# Altium project FOC_Lite.PrjPcb
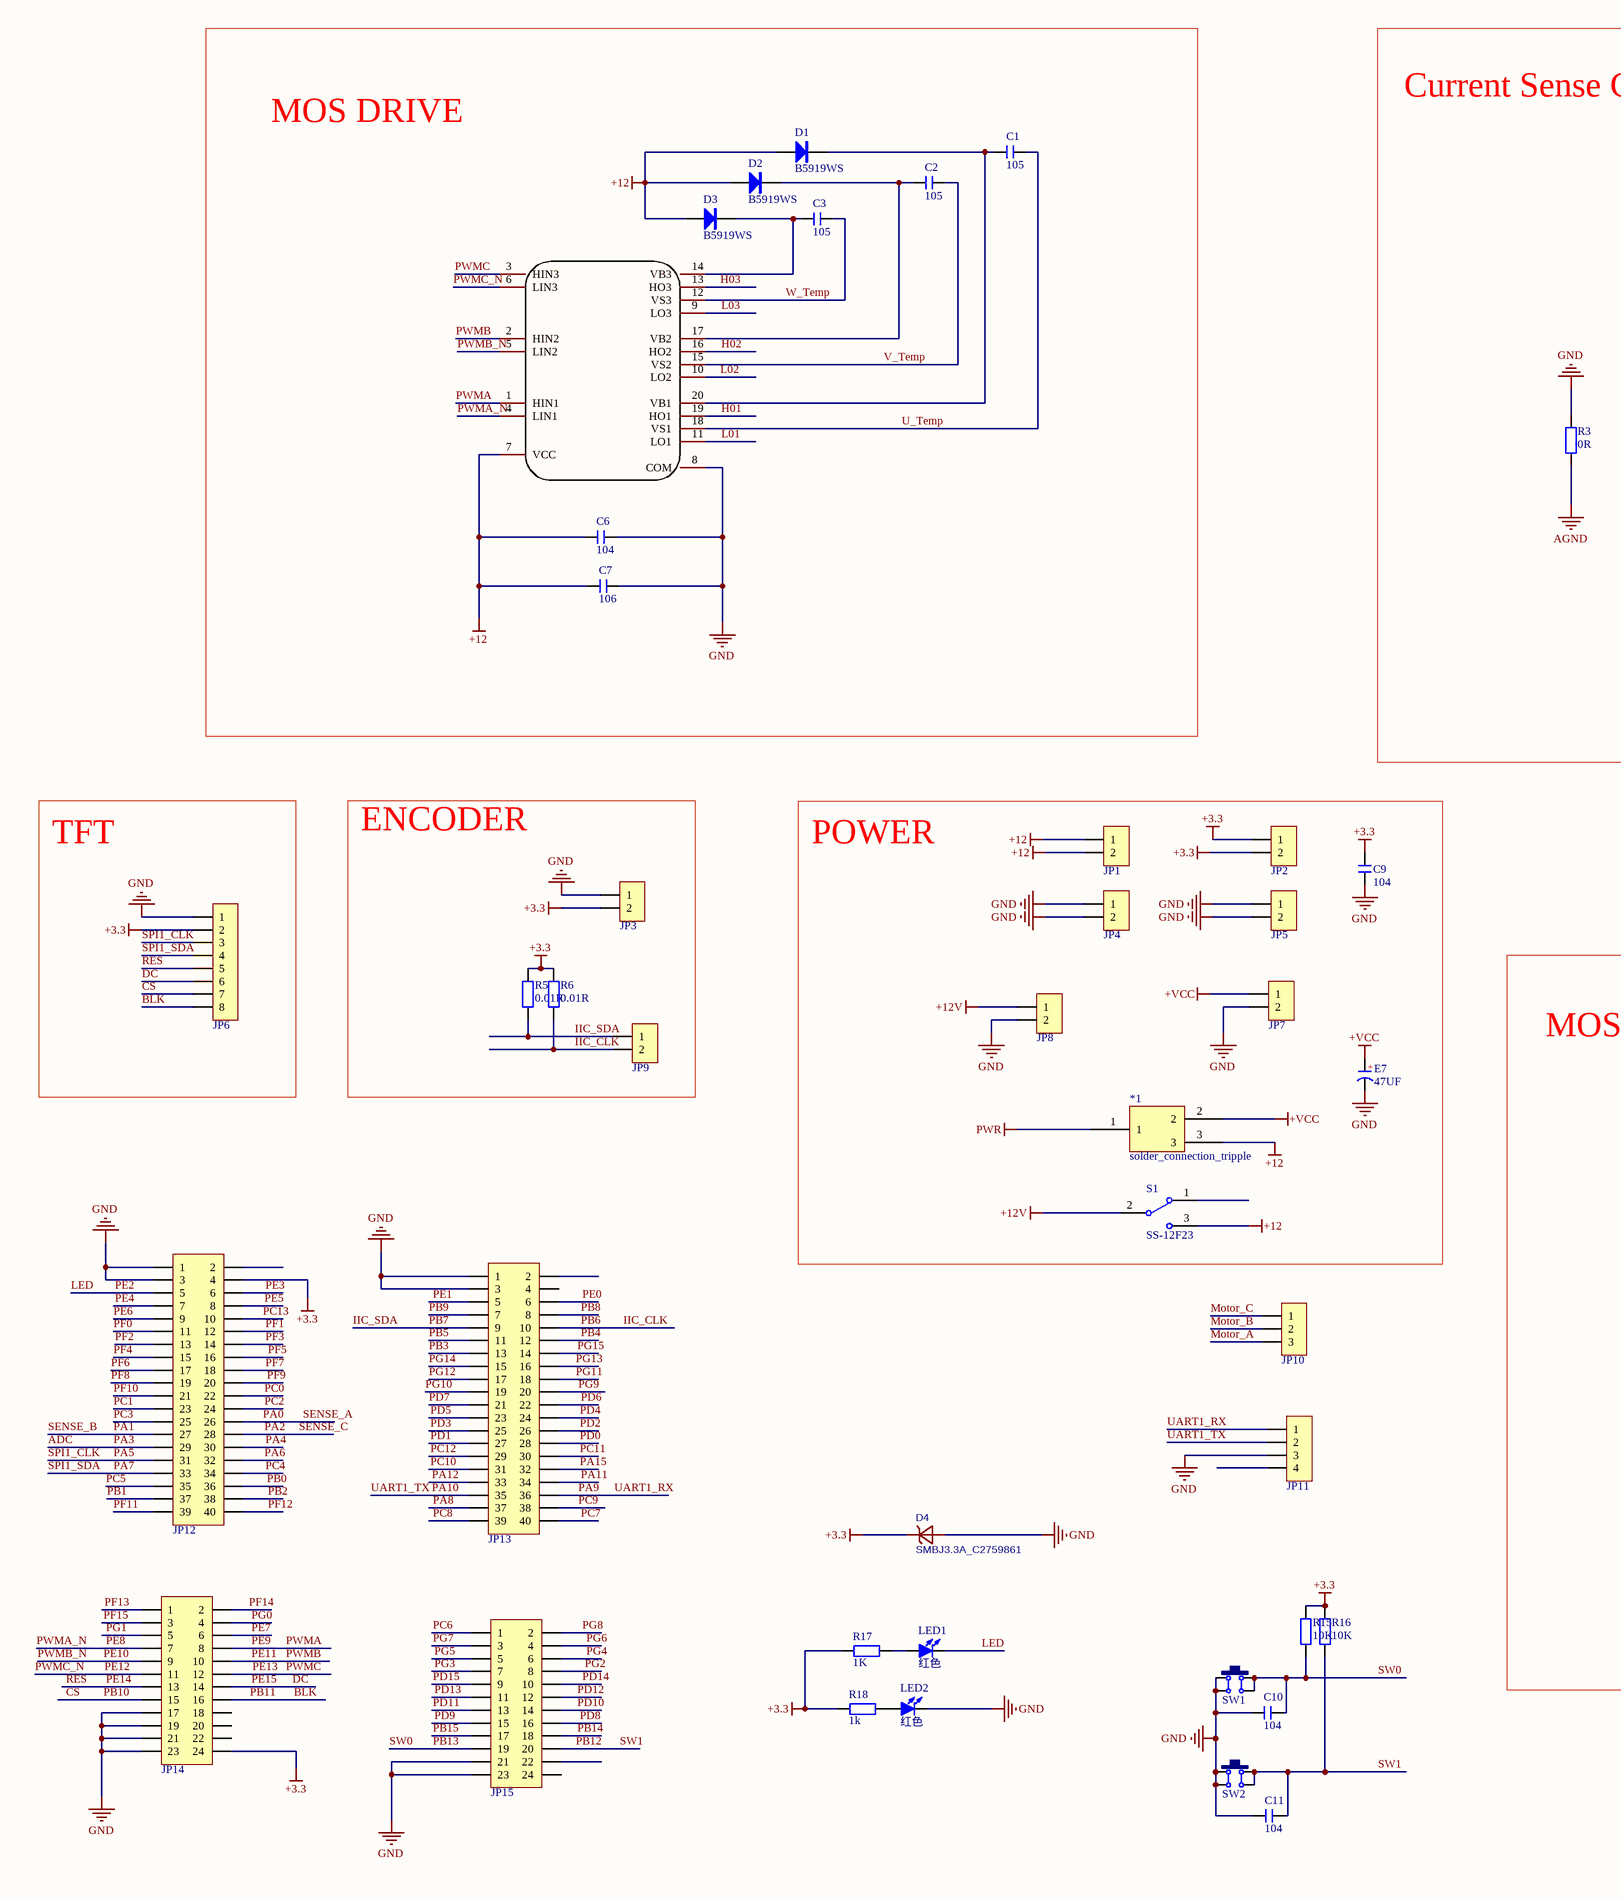
[diagram p0: FOC_Lite.SchDoc, left]
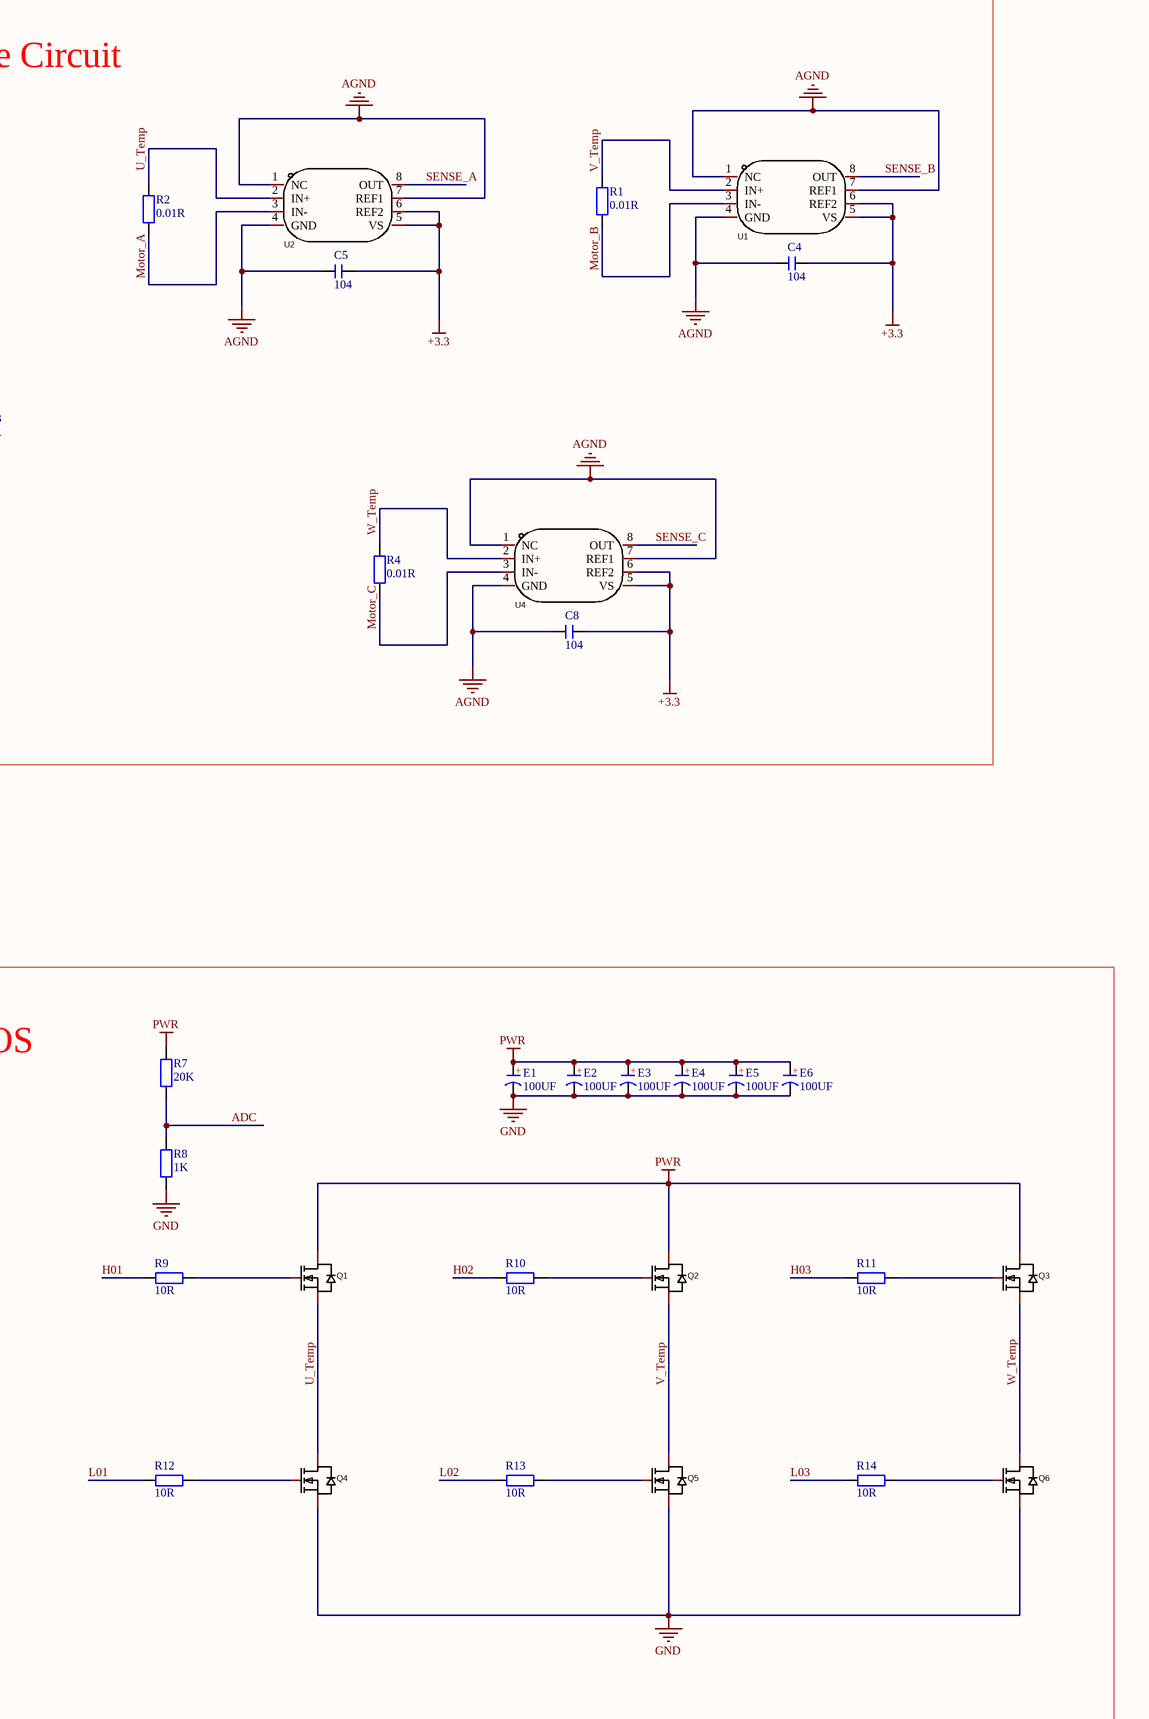
[diagram p1: FOC_Lite.SchDoc, right]
1 sheet, 71 parts. Net scope: global (net labels, ports and power ports of the same name join across sheets).
Board file: FOC_Lite.PcbDoc

## Sheet FOC_Lite.SchDoc
size A2

### Parts
*1  solder_connection_tripple  [solder_connection_tripple_big]
C1  105  [C 0805]
C2  105  [C 0805]
C3  105  [C 0805]
C4  104  [C 0805]
C5  104  [C 0805]
C6  104  [C 0805]
C7  106  [C 0805]
C8  104  [C 0805]
C9  104  [C 0805]
C10  104  [C 0603]
C11  104  [C 0603]
D1  B5919WS  [SOD-323]
D2  B5919WS  [SOD-323]
D3  B5919WS  [SOD-323]
D4  SMBJ3.3A_C2759861  [SMB3.3A]
E1  100UF  [CD D(7343)]
E2  100UF  [CD D(7343)]
E3  100UF  [CD D(7343)]
E4  100UF  [CD D(7343)]
E5  100UF  [CD D(7343)]
E6  100UF  [CD D(7343)]
E7  47UF  [CD D(7343)]
JP1  HDR-1X2  [HDR-1X2]  (value not drawn)
JP2  HDR-1X2  [HDR-1X2]  (value not drawn)
JP3  HDR-1X2  [HDR-1X2]  (value not drawn)
JP4  HDR-1X2  [HDR-1X2]  (value not drawn)
JP5  HDR-1X2  [HDR-1X2]  (value not drawn)
JP6  HDR-1X8  [HDR-1X8]  (value not drawn)
JP7  HDR-1X2  [KF128-5.08-2P]  (value not drawn)
JP8  HDR-1X2  [KF128-5.08-2P]  (value not drawn)
JP9  HDR-1X2  [HDR-1X2]  (value not drawn)
JP10  HDR-1X3  [KF128-5.08-3P]  (value not drawn)
JP11  HDR-1X4  [XH2.54-4P]  (value not drawn)
JP12  Header 2X11  [HDR-20X2]  (value not drawn)
JP13  Header 2X11  [HDR-20X2]  (value not drawn)
JP14  Header 2X11  [HDR-12X2]  (value not drawn)
JP15  Header 2X11  [HDR-12X2]  (value not drawn)
LED1  红色  [LED 0603W]
LED2  红色  [LED 0603W]
Q1  NCE6080K  [TO-252-2_L6.6-W6.1-P4.57-LS10.1-BR-CW]  (value not drawn)
Q2  NCE6080K  [TO-252-2_L6.6-W6.1-P4.57-LS10.1-BR-CW]  (value not drawn)
Q3  NCE6080K  [TO-252-2_L6.6-W6.1-P4.57-LS10.1-BR-CW]  (value not drawn)
Q4  NCE6080K  [TO-252-2_L6.6-W6.1-P4.57-LS10.1-BR-CW]  (value not drawn)
Q5  NCE6080K  [TO-252-2_L6.6-W6.1-P4.57-LS10.1-BR-CW]  (value not drawn)
Q6  NCE6080K  [TO-252-2_L6.6-W6.1-P4.57-LS10.1-BR-CW]  (value not drawn)
R1  0.01R  [R 2512]
R2  0.01R  [R 2512]
R3  0R  [R 0805]
R4  0.01R  [R 2512]
R5  0.01R  [R 0603]
R6  0.01R  [R 0603]
R7  20K  [R 0603]
R8  1K  [R 0603]
R9  10R  [R 2512]
R10  10R  [R 2512]
R11  10R  [R 2512]
R12  10R  [R 2512]
R13  10R  [R 2512]
R14  10R  [R 2512]
R15  10K  [R 0603]
R16  10K  [R 0603]
R17  1K  [R 0603]
R18  1k  [R 0603]
S1  SS-12F23  [SS12D10]
SW1  6x6x5  [TSW DIP-6*6*6]  (value not drawn)
SW2  6x6x5  [TSW DIP-6*6*6]  (value not drawn)
U1  INA240A2PWR  [TSSOP-8_L4.4-W3.0-P0.65-LS6.4-BL]  (value not drawn)
U2  INA240A2PWR  [TSSOP-8_L4.4-W3.0-P0.65-LS6.4-BL]  (value not drawn)
U3  FD6288T  [FD6288T]  (value not drawn)
U4  INA240A2PWR  [TSSOP-8_L4.4-W3.0-P0.65-LS6.4-BL]  (value not drawn)

### Blocks framed on the sheet
MOS DRIVE: C1-C3 C6 C7 D1-D3 U3
Current Sense Circuit: C4 C5 C8 R1-R4 U1 U2 U4
TFT: JP6
ENCODER: JP3 JP9 R5 R6
POWER: *1 C9 E7 JP1 JP2 JP4 JP5 JP7 JP8 S1
MOS: E1-E6 Q1-Q6 R7-R14

### Nets
+3.3: C4.2 C5.2 C8.2 C9.2 D4.1 JP2.1 JP2.2 JP3.2 JP6.2 JP12.4 JP14.24 R5.2 R6.2 R15.1 R16.1 R17.2 R18.1 U1.5(VS) U1.6(REF2) U2.5(VS) U2.6(REF2) U4.5(VS) U4.6(REF2)
+12: *1.3 C6.1 C7.1 D1.1(A) D2.1(A) D3.1(A) JP1.1 JP1.2 S1.3 U3.7(VCC)
+12V: JP8.1 S1.2
+VCC: *1.2 E7.1(A) JP7.1
AGND: C4.1 C5.1 C8.1 R3.1 U1.1(NC) U1.4(GND) U1.7(REF1) U2.1(NC) U2.4(GND) U2.7(REF1) U4.1(NC) U4.4(GND) U4.7(REF1)
GND: C6.2 C7.2 C9.1 C10.2 C11.2 D4.2 E1.2(K) E2.2(K) E3.2(K) E4.2(K) E5.2(K) E6.2(K) E7.2(K) JP3.1 JP4.1 JP4.2 JP5.1 JP5.2 JP6.1 JP7.2 JP8.2 JP11.3 JP12.1 JP12.3 JP13.1 JP13.3 JP14.17 JP14.19 JP14.21 JP14.23 JP15.21 JP15.23 LED2.2(K) Q4.3(S) Q5.3(S) Q6.3(S) R3.2 R8.2 SW1.1 SW1.4 SW2.1 SW2.4 U3.8(COM)
PWR: *1.1 E1.1(A) E2.1(A) E3.1(A) E4.1(A) E5.1(A) E6.1(A) Q1.2(D) Q2.2(D) Q3.2(D) R7.1
ADC: JP12.29 R7.2 R8.1  [also labelled PA3]
BLK: JP6.8 JP14.16  [also labelled PB11]
CS: JP6.7 JP14.15  [also labelled PB10]
DC: JP6.6 JP14.14  [also labelled PE15]
H01: R9.2 U3.19(HO1)
H02: R10.2 U3.16(HO2)
H03: R11.2 U3.13(HO3)
IIC_CLK: JP9.2 JP13.10 R6.1  [also labelled PB6]
IIC_SDA: JP9.1 JP13.9 R5.1  [also labelled PB7]
L01: R12.2 U3.11(LO1)
L02: R13.2 U3.10(LO2)
L03: R14.2 U3.9(LO3)
LED: JP12.5 LED1.2(K)  [also labelled PE2]
Motor_A: JP10.3 R2.1 U2.3(IN-)
Motor_B: JP10.2 R1.1 U1.3(IN-)
Motor_C: JP10.1 R4.1 U4.3(IN-)
PA0: JP12.26 U2.8(OUT)  [also labelled SENSE_A]
PA1: JP12.27 U1.8(OUT)  [also labelled SENSE_B]
PA2: JP12.28 U4.8(OUT)  [also labelled SENSE_C]
PA4: JP12.30
PA5: JP6.3 JP12.31  [also labelled SPI1_CLK]
PA6: JP12.32
PA7: JP6.4 JP12.33  [also labelled SPI1_SDA]
PA8: JP13.37
PA9: JP11.1 JP13.36  [also labelled UART1_RX]
PA10: JP11.2 JP13.35  [also labelled UART1_TX]
PA11: JP13.34
PA12: JP13.33
PA15: JP13.32
PB0: JP12.36
PB1: JP12.37
PB2: JP12.38
PB3: JP13.13
PB4: JP13.12
PB5: JP13.11
PB8: JP13.8
PB9: JP13.7
PB12: C11.1 JP15.20 R16.2 SW2.2 SW2.3  [also labelled SW1]
PB13: C10.1 JP15.19 R15.2 SW1.2 SW1.3  [also labelled SW0]
PB14: JP15.18
PB15: JP15.17
PC0: JP12.22
PC1: JP12.23
PC2: JP12.24
PC3: JP12.25
PC4: JP12.34
PC5: JP12.35
PC6: JP15.1
PC7: JP13.40
PC8: JP13.39
PC9: JP13.38
PC10: JP13.31
PC11: JP13.30
PC12: JP13.29
PC13: JP12.10
PD0: JP13.28
PD1: JP13.27
PD2: JP13.26
PD3: JP13.25
PD4: JP13.24
PD5: JP13.23
PD6: JP13.22
PD7: JP13.21
PD8: JP15.16
PD9: JP15.15
PD10: JP15.14
PD11: JP15.13
PD12: JP15.12
PD13: JP15.11
PD14: JP15.10
PD15: JP15.9
PE0: JP13.6
PE1: JP13.5
PE3: JP12.6
PE4: JP12.7
PE5: JP12.8
PE6: JP12.9
PE7: JP14.6
PE8: JP14.7 U3.4(LIN1)  [also labelled PWMA_N]
PE9: JP14.8 U3.1(HIN1)  [also labelled PWMA]
PE10: JP14.9 U3.5(LIN2)  [also labelled PWMB_N]
PE11: JP14.10 U3.2(HIN2)  [also labelled PWMB]
PE12: JP14.11 U3.6(LIN3)  [also labelled PWMC_N]
PE13: JP14.12 U3.3(HIN3)  [also labelled PWMC]
PE14: JP6.5 JP14.13  [also labelled RES]
PF0: JP12.11
PF1: JP12.12
PF2: JP12.13
PF3: JP12.14
PF4: JP12.15
PF5: JP12.16
PF6: JP12.17
PF7: JP12.18
PF8: JP12.19
PF9: JP12.20
PF10: JP12.21
PF11: JP12.39
PF12: JP12.40
PF13: JP14.1
PF14: JP14.2
PF15: JP14.3
PG0: JP14.4
PG1: JP14.5
PG2: JP15.8
PG3: JP15.7
PG4: JP15.6
PG5: JP15.5
PG6: JP15.4
PG7: JP15.3
PG8: JP15.2
PG9: JP13.20
PG10: JP13.19
PG11: JP13.18
PG12: JP13.17
PG13: JP13.16
PG14: JP13.15
PG15: JP13.14
U_Temp: C1.2 Q1.3(S) Q4.2(D) R2.2 U2.2(IN+) U3.18(VS1)
V_Temp: C2.2 Q2.3(S) Q5.2(D) R1.2 U1.2(IN+) U3.15(VS2)
W_Temp: C3.2 Q3.3(S) Q6.2(D) R4.2 U3.12(VS3) U4.2(IN+)
NetC1_1: C1.1 D1.2(K) U3.20(VB1)
NetC2_1: C2.1 D2.2(K) U3.17(VB2)
NetC3_1: C3.1 D3.2(K) U3.14(VB3)
NetLED1_1: LED1.1(A) R17.1
NetLED2_1: LED2.1(A) R18.2
NetQ1_1: Q1.1(G) R9.1
NetQ2_1: Q2.1(G) R10.1
NetQ3_1: Q3.1(G) R11.1
NetQ4_1: Q4.1(G) R12.1
NetQ5_1: Q5.1(G) R13.1
NetQ6_1: Q6.1(G) R14.1

Not connected (* = marked no-connect by the designer): JP11 4; JP12 2; JP13 2 4; JP14 18 20 22; JP15 22 24; S1 1

### Notes on the sheet
- Title
- Size:
- Date:
- File:
- A2
- Number:
- Time:
- Revision:
- Sheet
- of
- (in symbol C-CD) +

### Library data of the parts
C1-C11 = C: 无极性贴片电容; 版权归属: 黎明电子style; BOM名称: 无极性贴片电容; 学习资源: https://lmdzstyle.taobao.com/
D1-D3 = 1N5819: 肖特基二极管; 版权归属: 源创客; 属性: 40V/2A; BOM名称: 肖特基二极管; 学习资源: www.ooocke.com
D4 = SMBJ3.3A_C2759861: BOM_Manufacturer: Leiditech(雷卯电子); Contributor: LCSC; BOM_Supplier: LCSC; BOM_Supplier Part: C2759861; BOM_Manufacturer Part: SMBJ3.3A; BOM_JLCPCB Part Class: Extended Part; spicePre: D; spiceSymbolName: SMBJ3.3A_C2759861
E1-E7 = C-CD: 贴片钽电容; 版权归属: 黎明电子style; BOM名称: 贴片钽电容; 学习资源: https://lmdzstyle.taobao.com/
JP1-JP5 JP7-JP9 = Header 2: 2P接插件; 版权归属: 黎明电子style; BOM名称: 2P接插件; 学习资源: https://lmdzstyle.taobao.com/
JP6 = Header 8: 8P接插件; 版权归属: 黎明电子style; BOM名称: 8P接插件; 学习资源: https://lmdzstyle.taobao.com/
JP10 = Header 3: 3P接插件; 版权归属: 黎明电子style; BOM名称: 3P接插件; 学习资源: https://lmdzstyle.taobao.com/
JP11 = Header 4: 4P接插件; 版权归属: 黎明电子style; BOM名称: 4P接插件; 学习资源: https://lmdzstyle.taobao.com/
JP12 JP13 = Header 20X2: 20*2P接插件; 版权归属: 黎明电子style; BOM名称: 20*2P接插件; 学习资源: https://lmdzstyle.taobao.com/
JP14 JP15 = Header 12X2: 12*2P接插件; 版权归属: 黎明电子style; BOM名称: 12*2P接插件; 学习资源: https://lmdzstyle.taobao.com/
LED1 = LED-SMD: 贴片LED; 封装库来自淘宝卖家 ID：黄晶宝石: 其他店铺购入均为假冒，请立即申请退款，本店奖励2~5元现金; 卖家免费查找封装，联系售后: 唯一出售店铺网址https://shop463601444.taobao.com; BOM名称: 贴片LED
LED2 = LED-SMD: 贴片LED; 版权归属: 黎明电子style; BOM名称: 贴片LED; 学习资源: https://lmdzstyle.taobao.com/
Q1-Q6 = NCE6080K: Manufacturer: NCE(无锡新洁能); Add into BOM: yes; Type: N沟道; Drain Source Voltage (Vdss): 60V; Continuous Drain Current (Id): 80A; Power Dissipation (Pd): 110W; Drain Source On Resistance (RDS(on)@Vgs,Id): 8.5mΩ@10V,20A; Gate Threshold Voltage (Vgs(th)@Id): 4V@250uA; Name: NCE6080K; Symbol: NCE6080K; Device: NCE6080K; LCSC Part Name: N沟道 60V 80A; Supplier Part: C341705; Manufacturer Part: NCE6080K; Supplier Footprint: TO-252-2; JLCPCB Part Class: Extended Part; Datasheet: https://atta.szlcsc.com/upload/public/pdf/source/20181205/C341705_A98BB2E94DE599C81CD1E648BE453360.pdf; Supplier: LCSC; Convert to PCB: yes
R1-R18 = R: 贴片电阻; 版权归属: 黎明电子style; BOM名称: 贴片电阻; 学习资源: https://lmdzstyle.taobao.com/
S1 = SSW-1P: 1路波动开关; BOM名称: 波动开关; 版权归属: 黎明电子style; 学习资源: https://lmdzstyle.taobao.com/
SW1 SW2 = TSW DIP-6x6: 直插6x6轻触开关; 版权归属: 黎明电子style; BOM名称: 直插6x6轻触开关; 学习资源: https://lmdzstyle.taobao.com/
U1 U2 U4 = INA240A2PWR: Manufacturer: TI(德州仪器); Add into BOM: yes; Name: INA240A2PWR; Symbol: INA240A2PWR; Device: INA240A2PWR; LCSC Part Name: INA240A2PWR; Supplier Part: C129949; Manufacturer Part: INA240A2PWR; Supplier Footprint: TSSOP-8-3.0mm; JLCPCB Part Class: Extended Part; Datasheet: https://atta.szlcsc.com/upload/public/pdf/source/20170918/C129949_1505700148139974986.pdf; Supplier: LCSC; Convert to PCB: yes
U3 = FD6288T: Manufacturer: Fortior Tech(峰岹); Symbol: FD6288; Add into BOM: yes; Name: FD6288T; Device: FD6288T; LCSC Part Name: FD6288T; Supplier Part: C97683; Manufacturer Part: FD6288T; Supplier Footprint: TSSOP-20; JLCPCB Part Class: Extended Part; Datasheet: https://atta.szlcsc.com/upload/public/pdf/source/20180912/C97683_ECE58C9DF7F061C95E95DF4276B152DC.pdf; Supplier: LCSC; Convert to PCB: yes